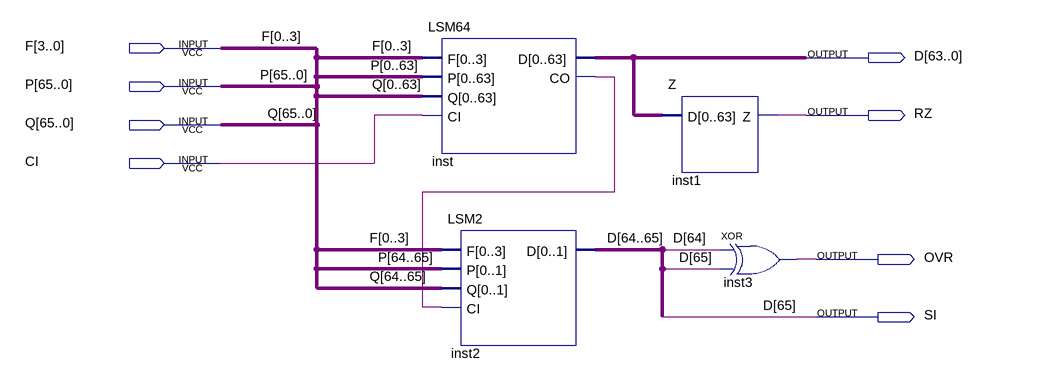
[diagram p0: schematic sheet]
// Quartus schematic Lab2.bdf as structural Verilog: 4 symbols, 8 pins
module Lab2 (
  input  [3:0] F,
  input  [65:0] P,
  input  [65:0] Q,
  input  CI,
  output [64:0] D,
  output RZ,
  output OVR,
  output SI
);

  wire inst_co;

  LSM64 inst (
    .F({F[0], F[1], F[2], F[3]}),
    .P({P[0], P[1], P[2], P[3], P[4], P[5], P[6], P[7], P[8], P[9], P[10], P[11], P[12], P[13], P[14], P[15], P[16], P[17], P[18], P[19], P[20], P[21], P[22], P[23], P[24], P[25], P[26], P[27], P[28], P[29], P[30], P[31], P[32], P[33], P[34], P[35], P[36], P[37], P[38], P[39], P[40], P[41], P[42], P[43], P[44], P[45], P[46], P[47], P[48], P[49], P[50], P[51], P[52], P[53], P[54], P[55], P[56], P[57], P[58], P[59], P[60], P[61], P[62], P[63]}),
    .Q({Q[0], Q[1], Q[2], Q[3], Q[4], Q[5], Q[6], Q[7], Q[8], Q[9], Q[10], Q[11], Q[12], Q[13], Q[14], Q[15], Q[16], Q[17], Q[18], Q[19], Q[20], Q[21], Q[22], Q[23], Q[24], Q[25], Q[26], Q[27], Q[28], Q[29], Q[30], Q[31], Q[32], Q[33], Q[34], Q[35], Q[36], Q[37], Q[38], Q[39], Q[40], Q[41], Q[42], Q[43], Q[44], Q[45], Q[46], Q[47], Q[48], Q[49], Q[50], Q[51], Q[52], Q[53], Q[54], Q[55], Q[56], Q[57], Q[58], Q[59], Q[60], Q[61], Q[62], Q[63]}),
    .CI(CI), .D(D[63:0]), .CO(inst_co));
  LSM2 inst2 (.F({F[0], F[1], F[2], F[3]}), .P({P[64], P[65]}), .Q({Q[64], Q[65]}), .CI(inst_co), .D({D[64], SI}));
  Z inst1 (.D(D[63:0]), .Z(RZ));
  xor inst3 (OVR, D[64], SI);

  // Other names for the same wires on the sheet: D[65] = SI
endmodule
